# Altium schematic sheet Sheet1_MotherBoard.SchDoc: MotherBoard Project's schematic
size A3; Author: Matthieu Hallo; CompanyName: YNOV Aeronautique
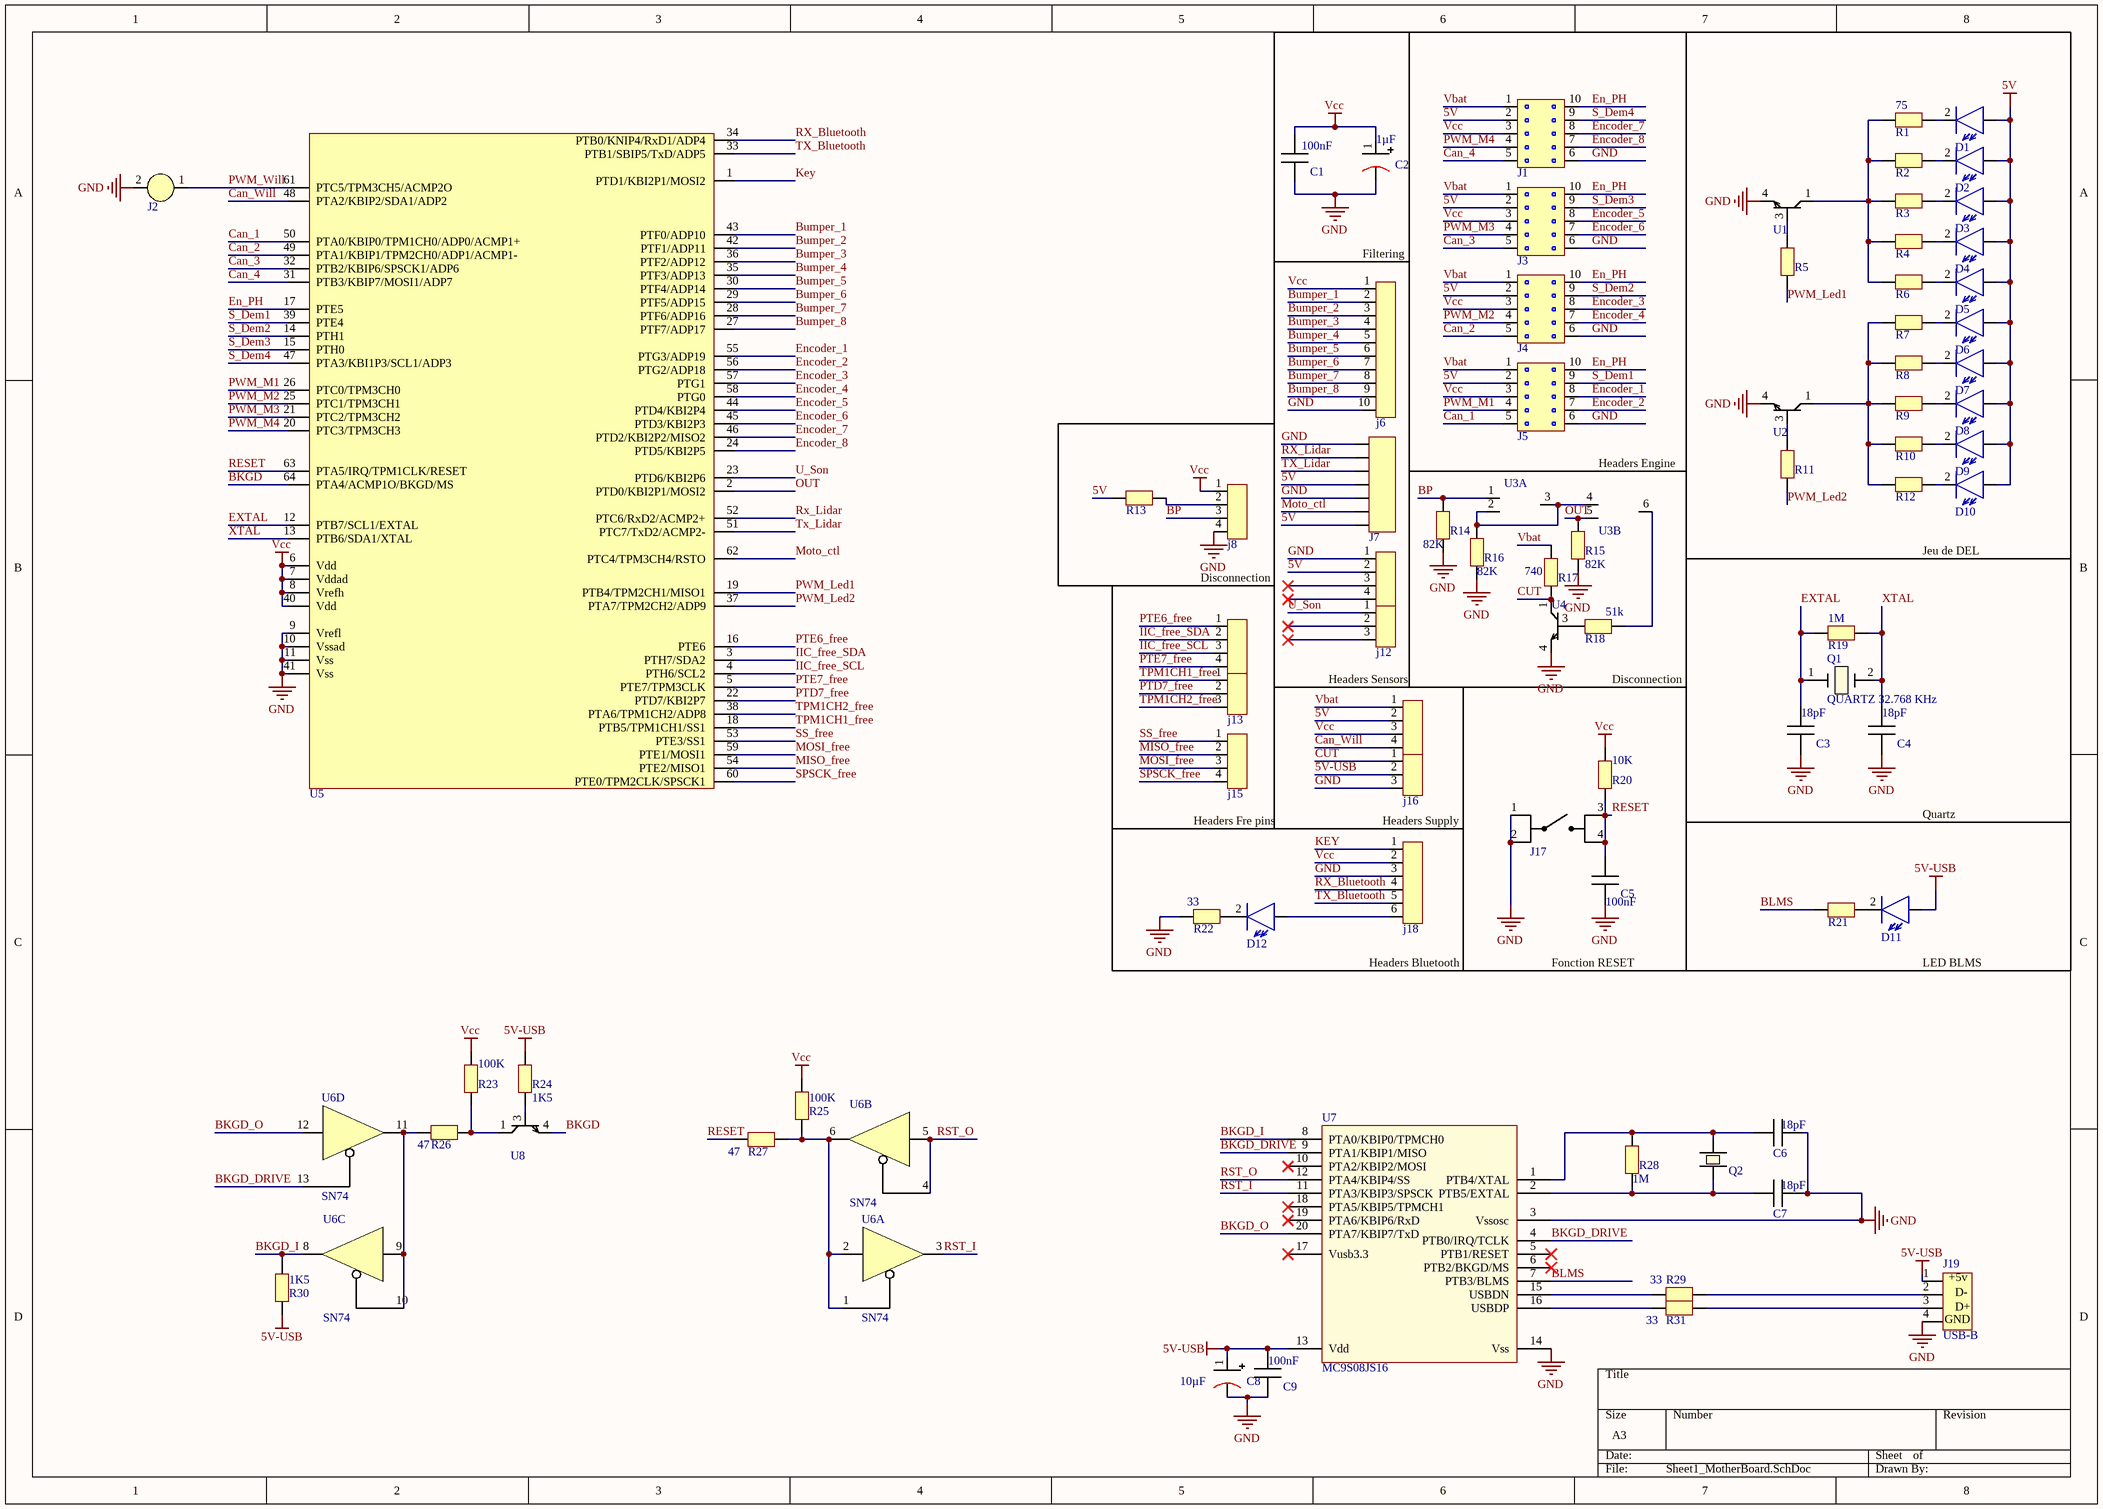
[diagram p0: Sheet1_MotherBoard.SchDoc]

## Parts
C1  CONDENSATEUR  [Condensateur 1206]  (value not drawn)
C2  Condensateur polarisée  [CONDENSATEUR 0805]  (value not drawn)
C3  CONDENSATEUR  [CONDENSATEUR 0805]  (value not drawn)
C4  CONDENSATEUR  [CONDENSATEUR 0805]  (value not drawn)
C5  CONDENSATEUR  [Condensateur 1206]  (value not drawn)
C6  CONDENSATEUR  [CONDENSATEUR 0805]  (value not drawn)
C7  CONDENSATEUR  [CONDENSATEUR 0805]  (value not drawn)
C8  Condensateur polarisée  [CONDENSATEUR 0805]  (value not drawn)
C9  CONDENSATEUR  [Condensateur 1206]  (value not drawn)
D1  LED  [LED]  (value not drawn)
D2  LED  [LED]  (value not drawn)
D3  LED  [LED]  (value not drawn)
D4  LED  [LED]  (value not drawn)
D5  LED  [LED]  (value not drawn)
D6  LED  [LED]  (value not drawn)
D7  LED  [LED]  (value not drawn)
D8  LED  [LED]  (value not drawn)
D9  LED  [LED]  (value not drawn)
D10  LED  [LED]  (value not drawn)
D11  LED  [LED]  (value not drawn)
D12  LED  [LED]  (value not drawn)
J1  MOLEX 10  [MOLEX]  (value not drawn)
J2  BUZZER  [BUZZER]  (value not drawn)
J3  MOLEX 10  [MOLEX]  (value not drawn)
J4  MOLEX 10  [MOLEX]  (value not drawn)
J5  MOLEX 10  [MOLEX]  (value not drawn)
j6  Header 10 pins  [Header 10 pins]  (value not drawn)
J7  Header 7 pins  [Header 7pins]  (value not drawn)
j8  Header 4 pins  [Header 4 pins]  (value not drawn)
j10  Header 4 pins  [Header 4 pins]  (value not drawn)
j11  Header 4 pins  [Header 4 pins]  (value not drawn)
j12  Header 3 pins  [Header 3 pins]  (value not drawn)
j13  Header 3 pins  [Header 3 pins]  (value not drawn)
j14  Header 4 pins  [Header 4 pins]  (value not drawn)
j15  Header 4 pins  [Header 4 pins]  (value not drawn)
j16  Header 3 pins  [Header 3 pins]  (value not drawn)
J17  Bouton poussoir  [Bouton poussoir]  (value not drawn)
j18  Header femelle 6 pins  [HEADER femelle 2.54 mm]  (value not drawn)
J19  USB-B  [USB]
Q1  QUARTZ 32.768 KHz  [quartz]
Q2  QUARTZ 12 MHz  [Quartz 12.00 MHz]  (value not drawn)
R1  RESISTANCE  [CONDENSATEUR 0805]  (value not drawn)
R2  RESISTANCE  [CONDENSATEUR 0805]  (value not drawn)
R3  RESISTANCE  [CONDENSATEUR 0805]  (value not drawn)
R4  RESISTANCE  [CONDENSATEUR 0805]  (value not drawn)
R5  RESISTANCE  [CONDENSATEUR 0805]  (value not drawn)
R6  RESISTANCE  [CONDENSATEUR 0805]  (value not drawn)
R7  RESISTANCE  [CONDENSATEUR 0805]  (value not drawn)
R8  RESISTANCE  [CONDENSATEUR 0805]  (value not drawn)
R9  RESISTANCE  [CONDENSATEUR 0805]  (value not drawn)
R10  RESISTANCE  [CONDENSATEUR 0805]  (value not drawn)
R11  RESISTANCE  [CONDENSATEUR 0805]  (value not drawn)
R12  RESISTANCE  [CONDENSATEUR 0805]  (value not drawn)
R13  RESISTANCE  [Condensateur 1206]  (value not drawn)
R14  RESISTANCE  [Condensateur 1206]  (value not drawn)
R15  RESISTANCE  [Condensateur 1206]  (value not drawn)
R16  RESISTANCE  [Condensateur 1206]  (value not drawn)
R17  RESISTANCE  [Condensateur 1206]  (value not drawn)
R18  RESISTANCE  [CONDENSATEUR 0805]  (value not drawn)
R19  RESISTANCE  [Condensateur 1206]  (value not drawn)
R20  RESISTANCE  [Condensateur 1206]  (value not drawn)
R21  RESISTANCE  [CONDENSATEUR 0805]  (value not drawn)
R22  RESISTANCE  [CONDENSATEUR 0805]  (value not drawn)
R23  RESISTANCE  [Condensateur 1206]  (value not drawn)
R24  RESISTANCE  [Condensateur 1206]  (value not drawn)
R25  RESISTANCE  [Condensateur 1206]  (value not drawn)
R26  RESISTANCE  [CONDENSATEUR 0805]  (value not drawn)
R27  RESISTANCE  [CONDENSATEUR 0805]  (value not drawn)
R28  RESISTANCE  [Condensateur 1206]  (value not drawn)
R29  RESISTANCE  [Condensateur 1206]  (value not drawn)
R30  RESISTANCE  [Condensateur 1206]  (value not drawn)
R31  RESISTANCE  [Condensateur 1206]  (value not drawn)
U1  Transistor led bleu  [transistor NPN]  (value not drawn)
U2  Transistor led bleu  [transistor NPN]  (value not drawn)
U3  Logic gate OR  [LogicGateNAND]  (value not drawn)  (parts A,B of 2)
U4  Transistor led bleu  [transistor NPN]  (value not drawn)
U5  MC9S08QE64CLH  [MC9S08QE64]  (value not drawn)
U6  SN74  [SN74LV125A]  (parts A,B,C,D of 4)
U7  MC9S08JS16  [MC9S08JS16CWJ]
U8  Transistor led bleu  [transistor NPN]  (value not drawn)

## Nets
5V: D1.1 D2.1 D3.1 D4.1 D5.1 D6.1 D7.1 D8.1 D9.1 D10.1 J1.2 J3.2 J4.2 J5.2 J7.4 J7.7 j11.2 j14.2 R13.1 U3.14
5V-USB: C8.1 C9.1 D11.1 j16.2 J19.1 R24.1 R30.2 U7.13(Vdd)
GND: C1.2 C2.2 C3.2 C4.2 C5.2 C6.1 C7.1 C8.2 C9.2 J1.6 J2.2 J3.6 J4.6 J5.6 j6.10 J7.1 J7.5 j8.4 j11.1 j16.3 J17.1 J17.2 j18.3 J19.4 R14.2 R15.2 R16.2 R22.1 U1.4 U2.4 U3.7 U4.4 U5.9(Vrefl) U5.10(Vssad) U5.11(Vss) U5.41(Vss) U6.7 U7.3(Vssosc) U7.14(Vss)
Vcc: C1.1 C2.1 J1.3 J3.3 J4.3 J5.3 j6.1 j8.1 j14.3 j18.2 R20.1 R23.1 R25.1 U5.6(Vdd) U5.7(Vddad) U5.8(Vrefh) U5.40(Vdd) U6.14
BKGD: U5.64(PTA4/ACMP1O/BKGD/MS) U8.4
BKGD_DRIVE: U6.13 U7.4(PTB0/IRQ/TCLK) U7.9(PTA1/KBIP1/MISO)
BKGD_I: R30.1 U6.8 U7.8(PTA0/KBIP0/TPMCH0)
BKGD_O: U6.12 U7.20(PTA7/KBIP7/TxD)
BLMS: R21.1 U7.7(PTB3/BLMS)
BP: j8.3 R14.1 U3.1
Bumper_1: j6.2 U5.43(PTF0/ADP10)
Bumper_2: j6.3 U5.42(PTF1/ADP11)
Bumper_3: j6.4 U5.36(PTF2/ADP12)
Bumper_4: j6.5 U5.35(PTF3/ADP13)
Bumper_5: j6.6 U5.30(PTF4/ADP14)
Bumper_6: j6.7 U5.29(PTF5/ADP15)
Bumper_7: j6.8 U5.28(PTF6/ADP16)
Bumper_8: j6.9 U5.27(PTF7/ADP17)
Can_1: J5.5 U5.50(PTA0/KBIP0/TPM1CH0/ADP0/ACMP1+)
Can_2: J4.5 U5.49(PTA1/KBIP1/TPM2CH0/ADP1/ACMP1-)
Can_3: J3.5 U5.32(PTB2/KBIP6/SPSCK1/ADP6)
Can_4: J1.5 U5.31(PTB3/KBIP7/MOSI1/ADP7)
Can_Will: j14.4 U5.48(PTA2/KBIP2/SDA1/ADP2)
CUT: j16.1 R17.2 U4.1
En_PH: J1.10 J3.10 J4.10 J5.10 U5.17(PTE5)
Encoder_1: J5.8 U5.55(PTG3/ADP19)
Encoder_2: J5.7 U5.56(PTG2/ADP18)
Encoder_3: J4.8 U5.57(PTG1)
Encoder_4: J4.7 U5.58(PTG0)
Encoder_5: J3.8 U5.44(PTD4/KBI2P4)
Encoder_6: J3.7 U5.45(PTD3/KBI2P3)
Encoder_7: J1.8 U5.46(PTD2/KBI2P2/MISO2)
Encoder_8: J1.7 U5.24(PTD5/KBI2P5)
EXTAL: C3.1 Q1.1 R19.1 U5.12(PTB7/SCL1/EXTAL)
IIC_free_SCL: j10.3 U5.4(PTH6/SCL2)
IIC_free_SDA: j10.2 U5.3(PTH7/SDA2)
Key: j18.1 U5.1(PTD1/KBI2P1/MOSI2)
MISO_free: j15.2 U5.54(PTE2/MISO1)
MOSI_free: j15.3 U5.59(PTE1/MOSI1)
Moto_ctl: J7.6 U5.62(PTC4/TPM3CH4/RSTO)
OUT: R15.1 U3.5 U5.2(PTD0/KBI2P1/MOSI2)
PTD7_free: j13.2 U5.22(PTD7/KBI2P7)
PTE6_free: j10.1 U5.16(PTE6)
PTE7_free: j10.4 U5.5(PTE7/TPM3CLK)
PWM_Led1: R5.2 U5.19(PTB4/TPM2CH1/MISO1)
PWM_Led2: R11.2 U5.37(PTA7/TPM2CH2/ADP9)
PWM_M1: J5.4 U5.26(PTC0/TPM3CH0)
PWM_M2: J4.4 U5.25(PTC1/TPM3CH1)
PWM_M3: J3.4 U5.21(PTC2/TPM3CH2)
PWM_M4: J1.4 U5.20(PTC3/TPM3CH3)
PWM_Will: J2.1 U5.61(PTC5/TPM3CH5/ACMP2O)
RESET: C5.1 J17.3 J17.4 R20.2 R27.1 U5.63(PTA5/IRQ/TPM1CLK/RESET)
RST_I: U6.3 U7.11(PTA3/KBIP3/SPSCK)
RST_O: U6.4 U6.5 U7.12(PTA4/KBIP4/SS)
RX_Bluetooth: j18.4 U5.34(PTB0/KNIP4/RxD1/ADP4)
Rx_Lidar: J7.2 U5.52(PTC6/RxD2/ACMP2+)
S_Dem1: J5.9 U5.39(PTE4)
S_Dem2: J4.9 U5.14(PTH1)
S_Dem3: J3.9 U5.15(PTH0)
S_Dem4: J1.9 U5.47(PTA3/KBI1P3/SCL1/ADP3)
SPSCK_free: j15.4 U5.60(PTE0/TPM2CLK/SPSCK1)
SS_free: j15.1 U5.53(PTE3/SS1)
TPM1CH1_free: j13.1 U5.18(PTB5/TPM1CH1/SS1)
TPM1CH2_free: j13.3 U5.38(PTA6/TPM1CH2/ADP8)
TX_Bluetooth: j18.5 U5.33(PTB1/SBIP5/TxD/ADP5)
Tx_Lidar: J7.3 U5.51(PTC7/TxD2/ACMP2-)
U_Son: j12.1 U5.23(PTD6/KBI2P6)
Vbat: J1.1 J3.1 J4.1 J5.1 j14.1 R17.1
XTAL: C4.1 Q1.2 R19.2 U5.13(PTB6/SDA1/XTAL)
NetC6_2: C6.2 Q2.1 R28.1 U7.1(PTB4/XTAL)
NetC7_2: C7.2 Q2.2 R28.2 U7.2(PTB5/EXTAL)
NetD1_2: D1.2 R1.2
NetD2_2: D2.2 R2.2
NetD3_2: D3.2 R3.2
NetD4_2: D4.2 R4.2
NetD5_2: D5.2 R6.2
NetD6_2: D6.2 R7.2
NetD7_2: D7.2 R8.2
NetD8_2: D8.2 R9.2
NetD9_2: D9.2 R10.2
NetD10_2: D10.2 R12.2
NetD11_2: D11.2 R21.2
NetD12_1: D12.1 j18.6
NetD12_2: D12.2 R22.2
Netj8_2: j8.2 R13.2
NetJ19_2: J19.2 R29.2
NetJ19_3: J19.3 R31.2
NetR1_1: R1.1 R2.1 R3.1 R4.1 R6.1 U1.1
NetR5_1: R5.1 U1.3
NetR7_1: R7.1 R8.1 R9.1 R10.1 R12.1 U2.1
NetR11_1: R11.1 U2.3
NetR16_1: R16.1 U3.2 U3.3 U3.4
NetR18_1: R18.1 U4.3
NetR18_2: R18.2 U3.6
NetR23_2: R23.2 R26.2 U8.1
NetR24_2: R24.2 U8.3
NetR25_2: R25.2 R27.2 U6.1 U6.2 U6.6
NetR26_1: R26.1 U6.9 U6.10 U6.11
NetR29_1: R29.1 U7.15(USBDN)
NetR31_1: R31.1 U7.16(USBDP)

Not connected (* = marked no-connect by the designer): j11 3* 4*; j12 2* 3*; U7 5(PTB1/RESET)* 6(PTB2/BKGD/MS)* 10(PTA2/KBIP2/MOSI)* 17(Vusb3.3)* 18(PTA5/KBIP5/TPMCH1)* 19(PTA6/KBIP6/RxD)*

## Notes on the sheet
- (near j6) Filtering
- Headers Engine
- Disconnection
- Jeu de DEL
- Headers Sensors
- (near j15) Headers Fre pins
- Headers Supply
- Quartz
- (near j18) Headers Bluetooth
- Fonction RESET
- (near D11) LED BLMS
- (in symbol CONDENSATEUR) 100nF; 18pF
- (in symbol Condensateur polarisée) 10µF; 1µF
- (in symbol RESISTANCE) 75; 1M; 51k; 82K; 740; 33; 47; 100K; 1K5; 10K
- (in symbol USB-B) +5v; D-; D+; GND

## Library data of the parts
D1-D12 = LED: DIODE ELECTROLUMINESCENTE
J1 J3-J5 = MOLEX 10: MOLEX Série Micro-Fit 3.0 43045
J2 = BUZZER: BUZZER 3V 2200 Hz
j6 = Header 10 pins: 10 pins
J7 = Header 7 pins: 7 pins
j8 j10 j11 j14 j15 = Header 4 pins: 4 pins
j12 j13 j16 = Header 3 pins: 3 pins
j18 = Header femelle 6 pins: 6 pins
U1 U2 U4 U8 = Transistor led bleu: Transistor NPN 5181659
U3 = Logic gate OR: OR 7432